# Altium schematic sheet Peripherals.SchDoc
size A3; SheetNumber: 3; SheetTotal: 5
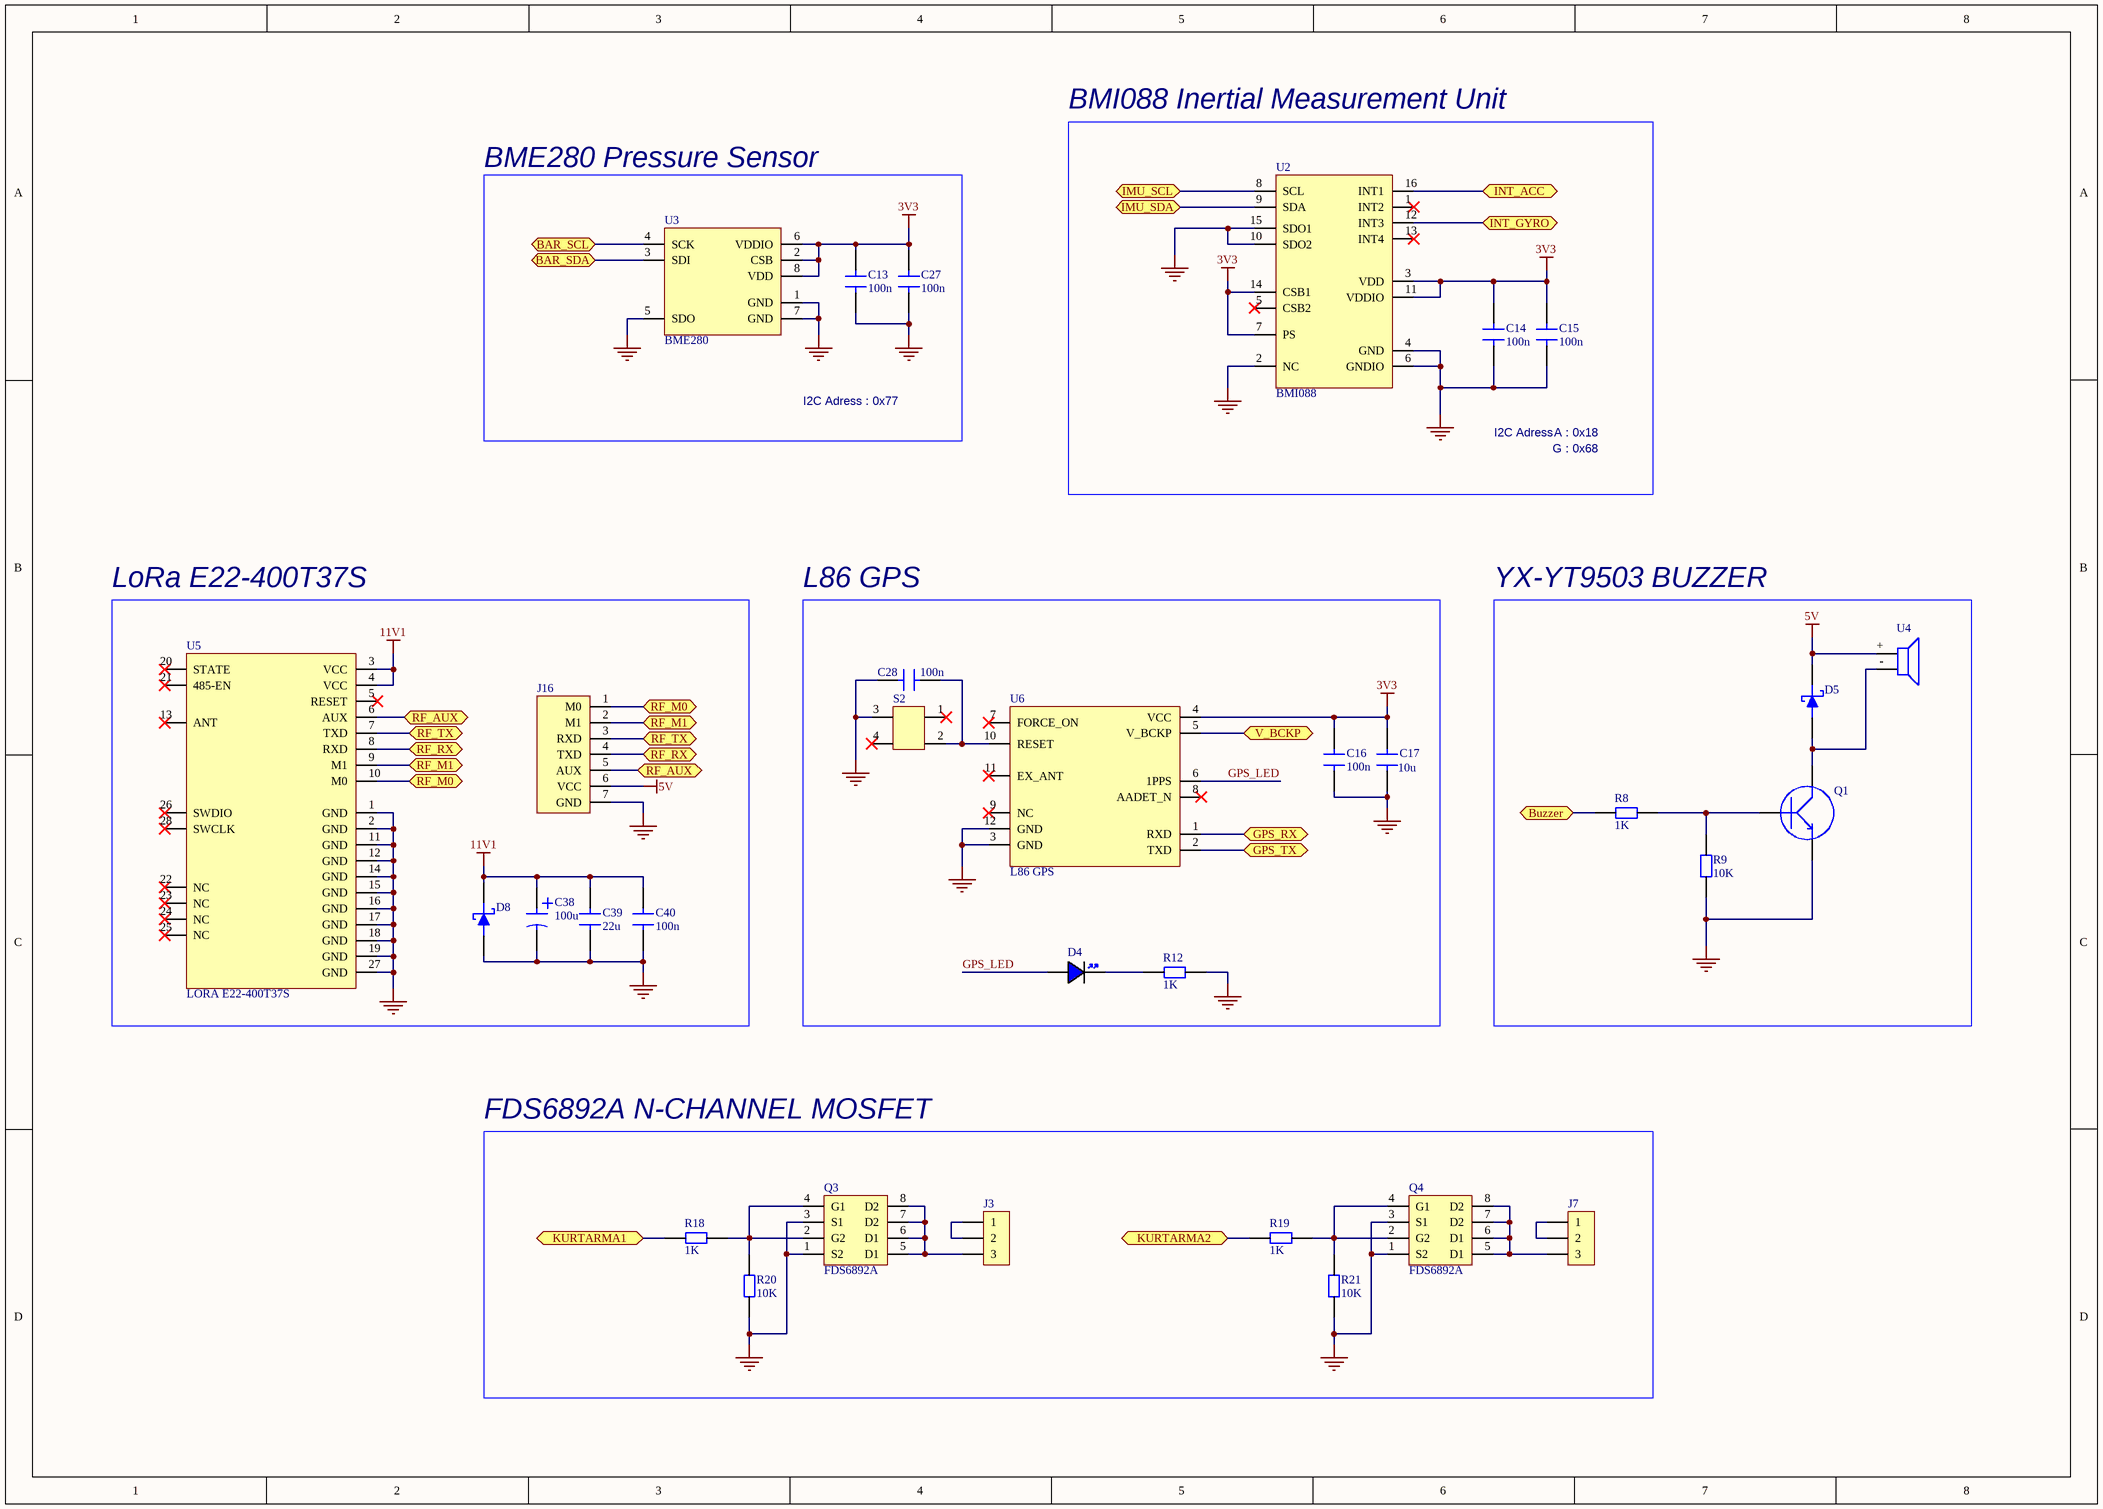
[diagram p0: Peripherals.SchDoc]

## Parts
C13  100n  [CAP 0603]
C14  100n  [CAP 0603]
C15  100n  [CAP 0603]
C16  100n  [CAP 0603]
C17  10u  [CAP 0805]
C27  100n  [CAP 0603]
C28  100n  [CAP 0603]
C38  100u  [865060653010]
C39  22u  [CAP 1210]
C40  100n  [CAP 0805]
D4  LED 0805 BLUE  [LED 0805 BLUE]  (value not drawn)
D5  TMBAT49FILM  [TMBAT49FILM]  (value not drawn)
D8  SMBJ14CA  [SMBJ12CA-13-F]  (value not drawn)
J3  JST B3B-XH-A  [JST_B3B-XH-A]  (value not drawn)
J7  JST B3B-XH-A  [JST_B3B-XH-A]  (value not drawn)
J16  LoRa E22-433T30D H  [LoRa E22-433T30D H]  (value not drawn)
Q1  BC817-25W,115  [BC817-25]  (value not drawn)
Q3  FDS6892A  [DMG4822SSD-13]
Q4  FDS6892A  [DMG4822SSD-13]
R8  1K  [RES 0603]
R9  10K  [RES 0603]
R12  1K  [RES 0603]
R18  1K  [RES 0805]
R19  1K  [RES 0805]
R20  10K  [RES 0805]
R21  10K  [RES 0805]
S2  FSM4JSMATR  [FSM4JSMATR]  (value not drawn)
U2  BMI088  [BMI088]
U3  BME280  [BME280]
U4  YX-YT9503  [YX-YT9503]  (value not drawn)
U5  LORA E22-400T37S  [LORA E22-400T37S]
U6  L86 GPS  [L86]

## Blocks framed on the sheet
BMI088 Inertial Measurement Unit: C14 C15 U2
BME280 Pressure Sensor: C13 C27 U3
LoRa E22-400T37S: C38-C40 D8 J16 U5
L86 GPS: C16 C17 C28 D4 R12 S2 U6
YX-YT9503 BUZZER: D5 Q1 R8 R9 U4
FDS6892A N-CHANNEL MOSFET: J3 J7 Q3 Q4 R18-R21

## Ports
BAR_SCL (bidir, see Connectors[3C], MCU[4C]), BAR_SDA (bidir, see Connectors[3C], MCU[4C]), Buzzer (bidir, see MCU[4C]), GPS_RX (bidir, see MCU[4B]), GPS_TX (bidir, see MCU[4B]), IMU_SCL (bidir, see Connectors[4C], MCU[4B]), IMU_SDA (bidir, see Connectors[4C], MCU[2C]), INT_ACC (bidir, see MCU[4C]), INT_GYRO (bidir, see MCU[4C]), KURTARMA1 (bidir, see MCU[2C]), KURTARMA2 (bidir, see MCU[2C]), RF_AUX (bidir, see MCU[4C], Peripherals[2B]), RF_AUX (bidir, see MCU[4C], Peripherals[3C]), RF_M0 (bidir, see MCU[2C], Peripherals[2C]), RF_M0 (bidir, see MCU[2C], Peripherals[3B]), RF_M1 (bidir, see MCU[2C], Peripherals[2C]), RF_M1 (bidir, see MCU[2C], Peripherals[3B]), RF_RX (bidir, see MCU[4B], Peripherals[2B]), RF_RX (bidir, see MCU[4B], Peripherals[3B]), RF_TX (bidir, see MCU[4B], Peripherals[2B]), RF_TX (bidir, see MCU[4B], Peripherals[3B]), V_BCKP (bidir, see MCU[3A], Power[3C])

## Nets
3V3: C13.2 C14.2 C15.2 C16.2 C17.2 C27.2 U2.3(VDD) U2.7(PS) U2.11(VDDIO) U2.14(CSB1) U3.2(CSB) U3.6(VDDIO) U3.8(VDD) U6.4(VCC)
5V: D5.1 J16.6(VCC) U4.+
11V1: C38.1(P) C39.2 C40.2 D8.2 U5.3(VCC) U5.4(VCC)
GND: C13.1 C14.1 C15.1 C16.1 C17.1 C27.1 C28.1 C38.2(N) C39.1 C40.1 D8.1 J16.7(GND) Q1.2(E) Q3.1(S2) Q3.3(S1) Q4.1(S2) Q4.3(S1) R9.1 R12.2 R20.1 R21.1 S2.3 U2.2(NC) U2.4(GND) U2.6(GNDIO) U2.10(SDO2) U2.15(SDO1) U3.1(GND) U3.5(SDO) U3.7(GND) U5.1(GND) U5.2(GND) U5.11(GND) U5.12(GND) U5.14(GND) U5.15(GND) U5.16(GND) U5.17(GND) U5.18(GND) U5.19(GND) U5.27(GND) U6.3(GND) U6.12(GND)
BAR_SCL: U3.4(SCK) ; port BAR_SCL
BAR_SDA: U3.3(SDI) ; port BAR_SDA
Buzzer: R8.1 ; port Buzzer
GPS_LED: D4.A U6.6(1PPS)
GPS_RX: U6.1(RXD) ; port GPS_RX
GPS_TX: U6.2(TXD) ; port GPS_TX
IMU_SCL: U2.8(SCL) ; port IMU_SCL
IMU_SDA: U2.9(SDA) ; port IMU_SDA
INT_ACC: U2.16(INT1) ; port INT_ACC
INT_GYRO: U2.12(INT3) ; port INT_GYRO
KURTARMA1: R18.1 ; port KURTARMA1
KURTARMA2: R19.1 ; port KURTARMA2
RF_AUX: J16.5(AUX) U5.6(AUX) ; port RF_AUX
RF_M0: J16.1(M0) U5.10(M0) ; port RF_M0
RF_M1: J16.2(M1) U5.9(M1) ; port RF_M1
RF_RX: J16.4(TXD) U5.8(RXD) ; port RF_RX
RF_TX: J16.3(RXD) U5.7(TXD) ; port RF_TX
V_BCKP: U6.5(V_BCKP) ; port V_BCKP
NetC28_2: C28.2 S2.2 U6.10(RESET)
NetD4_K: D4.K R12.1
NetD5_2: D5.2 Q1.3(C) U4.-
NetJ3_1: J3.1 J3.2
NetJ3_3: J3.3 Q3.5(D1) Q3.6(D1) Q3.7(D2) Q3.8(D2)
NetJ7_1: J7.1 J7.2
NetJ7_3: J7.3 Q4.5(D1) Q4.6(D1) Q4.7(D2) Q4.8(D2)
NetQ1_1: Q1.1(B) R8.2 R9.2
NetQ3_2: Q3.2(G2) Q3.4(G1) R18.2 R20.2
NetQ4_2: Q4.2(G2) Q4.4(G1) R19.2 R21.2

Not connected (* = marked no-connect by the designer): S2 1* 4*; U2 1(INT2)* 5(CSB2)* 13(INT4)*; U5 5(RESET)* 13(ANT)* 20(STATE)* 21(485-EN)* 22(NC)* 23(NC)* 24(NC)* 25(NC)* 26(SWDIO)* 28(SWCLK)*; U6 7(FORCE_ON)* 8(AADET_N)* 9(NC)* 11(EX_ANT)*

## Notes on the sheet
- I2C Adress : 0x77
- I2C Adress
- G : 0x68
- A : 0x18

## Library data of the parts
C13-C16 C27 C28 = CAP 0603 50V: Capacitor SMD 0603 50V
C17 = CAP 0805 25V: Capacitor SMD 0805 25V
C38 = 865060653010: Aluminum Electrolytic Capacitor, Polarized, Aluminum (wet), 50V, 20% +Tol, 20% -Tol, 100uF, Surface Mount, 3333; Manufacturer: Wurth Electronics; Supplier 1: Farnell; Manufacturer Part Number: 865060653010; RoHS: Yes; Category: Aluminum Electrolytic Capacitors; Stock 1: 176; Pricing 1: 1=0,825, 10=0,63, 50=0,551, 100=0,481, 200=0,427, 500=0,355, 2500=0,348, 5000=0,341 (EUR); ComponentLink1URL: http://www.farnell.com/datasheets/1880078.pdf?src-supplier=Farnell; ComponentLink1Description: http://www.farnell.com/datasheets/1880078.pdf?src-supplier=Farnell; ComponentLink2URL: http://www.farnell.com/datasheets/1880078.pdf?src-supplier=Newark; ComponentLink2Description: http://www.farnell.com/datasheets/1880078.pdf?src-supplier=Newark; ComponentLink3URL: http://www.farnell.com/datasheets/1880078.pdf?src-supplier=Element14; ComponentLink3Description: http://www.farnell.com/datasheets/1880078.pdf?src-supplier=Element14; ComponentLink4URL: https://katalog.we-online.de/pbs/datasheet/865060653010.pdf?src-supplier=Digikey; ComponentLink4Description: https://katalog.we-online.de/pbs/datasheet/865060653010.pdf?src-supplier=Digikey
C39 = CAP 1210 25V: Capacitor SMD 1210 25V
C40 = CAP 0805 50V: Capacitor SMD 0805 50V
D4 = LED 0805 BLUE: LED 0805 GREEN SMD
D5 = TMBAT49FILM: Rectifier Diode Small Signal Schottky Si 80V 0.5A 2-Pin MELF T/R; Manufacturer: STMicroelectronics; Supplier 1: Mouser; Manufacturer Part Number: TMBAT49FILM; RoHS: Yes; Category: Rectifier Diodes; Stock 1: 11456; Pricing 1: 1=0,55, 10=0,468, 50=0,468, 100=0,326, 1000=0,228, 10000=0,159 (USD); ComponentLink1URL: https://datasheet.ciiva.com/4715/cd00000809-92451-4715102.pdf?src-supplier=Mouser; ComponentLink1Description: https://datasheet.ciiva.com/4715/cd00000809-92451-4715102.pdf?src-supplier=Mouser; ComponentLink2URL: https://datasheet.ciiva.com/16988/0900766b80db299a-16988744.pdf?src-supplier=Allied+Electronics; ComponentLink2Description: https://datasheet.ciiva.com/16988/0900766b80db299a-16988744.pdf?src-supplier=Allied+Electronics; ComponentLink3URL: https://datasheet.ciiva.com/22697/1766334-22697011.pdf?src-supplier=Element14; ComponentLink3Description: https://datasheet.ciiva.com/22697/1766334-22697011.pdf?src-supplier=Element14; ComponentLink4URL: https://datasheet.ciiva.com/16501/cd00000809-16501349.pdf?src-supplier=Future+Electronics; ComponentLink4Description: https://datasheet.ciiva.com/16501/cd00000809-16501349.pdf?src-supplier=Future+Electronics; ComponentLink5URL: https://datasheet.ciiva.com/15144/getdatasheetpartid-39750-15144086.pdf?src-supplier=Verical; ComponentLink5Description: https://datasheet.ciiva.com/15144/getdatasheetpartid-39750-15144086.pdf?src-supplier=Verical; ComponentLink6URL: https://datasheet.ciiva.com/915/cd00000809-915819.pdf?src-supplier=Digikey; ComponentLink6Description: https://datasheet.ciiva.com/915/cd00000809-915819.pdf?src-supplier=Digikey; ComponentLink7URL: https://datasheet.ciiva.com/915/cd00000809-915820.pdf?src-supplier=Digikey; ComponentLink7Description: https://datasheet.ciiva.com/915/cd00000809-915820.pdf?src-supplier=Digikey; ComponentLink8URL: https://datasheet.ciiva.com/915/cd00000809-915821.pdf?src-supplier=Digikey; ComponentLink8Description: https://datasheet.ciiva.com/915/cd00000809-915821.pdf?src-supplier=Digikey; ComponentLink9URL: https://datasheet.ciiva.com/7622/1766334-7622348.pdf?src-supplier=Element14; ComponentLink9Description: https://datasheet.ciiva.com/7622/1766334-7622348.pdf?src-supplier=Element14; ComponentLink10URL: https://datasheet.ciiva.com/7964/cd00000809-7964118.pdf?src-supplier=Element14; ComponentLink10Description: https://datasheet.ciiva.com/7964/cd00000809-7964118.pdf?src-supplier=Element14
D8 = SMBJ14CA: TVS DIODE 14VWM 23.2VC DO214AA; Manufacturer: Littelfuse; Operating Supply Voltage: 14V; Max Surge Current: 25.9A; Number of Channels: 1; Polarity: Bidirectional; Breakdown Voltage: 15.6V; Clamping Voltage: 23.2V; Peak Pulse Power: 600W; Power Line Protection: No; Test Current: 1mA; Leakage Current: 1uA; Diode Type: ZENER; Max Breakdown Voltage: 17.2V; Supplier 1: Future Electronics; Manufacturer Part Number: SMBJ14CA; RoHS: Yes; Category: TVS Diodes; Stock 1: 1300; Pricing 1: 1=0,36, 15=0,29, 75=0,245, 300=0,205, 1500=0,163 (USD); Mount: Surface Mount; Case/Package: DO-214AA; Number of Pins: 2; Weight: 0.00328oz; Min Operating Temperature: -65°C; Max Operating Temperature: 150°C; Packaging: Tape and Reel; Package Quantity: 3000; Reverse Breakdown Voltage: 15.6V; Number of Bidirectional Channels: 1; Reverse Standoff Voltage: 14V; Min Breakdown Voltage: 15.6V; Number of Elements: 1; Peak Pulse Current: 25.9A; Voltage Rating (DC): 14V; Series: SMBJ; Direction: Bidirectional; Termination: SMD/SMT; Max Power Dissipation: 600W; Power Dissipation: 600W; Current: 1mA; Voltage: 14V; Clamping Voltage-Max: 23.2V; Length: 5.59mm; Width: 3.94mm; Height: 2.44mm; RoHS Compliant: Yes; Lead Free: Lead Free; Reach SVHC Compliant: No; ComponentLink1URL: https://datasheet.ciiva.com/331/littelfuse-tvs-diode-smbj-datasheet-pdf-331530.pdf?src-supplier=Digikey; ComponentLink1Description: https://datasheet.ciiva.com/331/littelfuse-tvs-diode-smbj-datasheet-pdf-331530.pdf?src-supplier=Digikey; ComponentLink2URL: https://datasheet.ciiva.com/331/littelfuse-tvs-diode-smbj-datasheet-pdf-331531.pdf?src-supplier=Digikey; ComponentLink2Description: https://datasheet.ciiva.com/331/littelfuse-tvs-diode-smbj-datasheet-pdf-331531.pdf?src-supplier=Digikey; ComponentLink3URL: https://datasheet.ciiva.com/331/littelfuse-tvs-diode-smbj-datasheet-pdf-331529.pdf?src-supplier=Digikey; ComponentLink3Description: https://datasheet.ciiva.com/331/littelfuse-tvs-diode-smbj-datasheet-pdf-331529.pdf?src-supplier=Digikey
J3 J7 = JST B3B-XH-A: Connector Header, XH Series, 3 Position, 2.50mm, Through Hole, Press-Fit, Solder, Natural; Manufacturer Part Number: B3B-XH-A(LF)(SN); Supplier 1: CoreStaff; Manufacturer: JST; RoHS: Yes; Category: Headers and Wire Housings; Stock 1: 2101; Pricing 1: 1=39,94, 10=25,1, 50=21,68, 100=18,25, 500=17,57, 1000=17,12, 2000=16,44, 4000=15,79 (JPY); ComponentLink1URL: https://datasheet.ciiva.com/26894/getdatasheetpartid-640434-26894454.pdf?src-supplier=Verical; ComponentLink1Description: https://datasheet.ciiva.com/26894/getdatasheetpartid-640434-26894454.pdf?src-supplier=Verical; ComponentLink2URL: https://datasheet.ciiva.com/26894/getdatasheetpartid-440399-26894778.pdf?src-supplier=Verical; ComponentLink2Description: https://datasheet.ciiva.com/26894/getdatasheetpartid-440399-26894778.pdf?src-supplier=Verical; ComponentLink3URL: https://datasheet.ciiva.com/11746/0900766b8082653f-11746520.pdf?src-supplier=Rs; ComponentLink3Description: https://datasheet.ciiva.com/11746/0900766b8082653f-11746520.pdf?src-supplier=Rs
J16 = LoRa E22-433T30D H: E220-400T30D LoRa Module Header
Q1 = BC817-25W,115: BC817 Series 45 V 500 mA NPN General Purpose Transistor - SOT-23; Manufacturer: Nexperia; Supplier 1: Future Electronics; Manufacturer Part Number: BC817-25W,115; RoHS: Yes; Category: BJTs; Stock 1: 99000; Pricing 1: 3000=0,0169, 12000=0,0162, 45000=0,0155, 90000=0,0152, 225000=0,0144 (USD); ComponentLink1URL: https://datasheet.octopart.com/BC817-25W%2C115-NXP-datasheet-29749.pdf?src-supplier=Future+Electronics; ComponentLink1Description: https://datasheet.octopart.com/BC817-25W%2C115-NXP-datasheet-29749.pdf?src-supplier=Future+Electronics; ComponentLink2URL: http://www.farnell.com/datasheets/699988.pdf?src-supplier=Newark; ComponentLink2Description: http://www.farnell.com/datasheets/699988.pdf?src-supplier=Newark; ComponentLink3URL: https://datasheet.octopart.com/BC817-25W%2C115-Nexperia-datasheet-155782301.pdf?src-supplier=TME; ComponentLink3Description: https://datasheet.octopart.com/BC817-25W%2C115-Nexperia-datasheet-155782301.pdf?src-supplier=TME; Supplier Part Number 1: 5067352
Q3 Q4 = FDS6892A: Dual N-Channel Logic Level PWM Optimized PowerTrench® MOSFET 20V, 7.5A, 18mΩ; Manufacturer: ON Semiconductor / Fairchild; Supplier 1: Arrow Electronics; Manufacturer Part Number: FDS6892A; RoHS: Yes; Category: MOSFETs; Stock 1: 45; Pricing 1: 1=0,4552, 539=0,4077 (USD); ComponentLink1URL: https://datasheet.ciiva.com/15137/getdatasheetpartid-60185-15137252.pdf?src-supplier=Verical; ComponentLink1Description: https://datasheet.ciiva.com/15137/getdatasheetpartid-60185-15137252.pdf?src-supplier=Verical; ComponentLink2URL: https://datasheet.ciiva.com/8114/fds6892a-8114609.pdf?src-supplier=Avnet; ComponentLink2Description: https://datasheet.ciiva.com/8114/fds6892a-8114609.pdf?src-supplier=Avnet; ComponentLink3URL: https://datasheet.ciiva.com/6076/89392-6076006.pdf?src-supplier=Farnell; ComponentLink3Description: https://datasheet.ciiva.com/6076/89392-6076006.pdf?src-supplier=Farnell; ComponentLink4URL: https://datasheet.ciiva.com/4442/fds6892a-108922-4442276.pdf?src-supplier=Mouser; ComponentLink4Description: https://datasheet.ciiva.com/4442/fds6892a-108922-4442276.pdf?src-supplier=Mouser; ComponentLink5URL: https://datasheet.ciiva.com/16777/fds6892a-16777782.pdf?src-supplier=Future+Electronics; ComponentLink5Description: https://datasheet.ciiva.com/16777/fds6892a-16777782.pdf?src-supplier=Future+Electronics; ComponentLink6URL: https://datasheet.ciiva.com/6386/fds6892a-6386538.pdf?src-supplier=Digikey; ComponentLink6Description: https://datasheet.ciiva.com/6386/fds6892a-6386538.pdf?src-supplier=Digikey
R8 R9 R12 = RES 0603: Resistor SMD 0603
R18-R21 = RES 0805: Resistor SMD 0805
S2 = FSM4JSMATR: Switch Tactile OFF (ON) SPST Round Button Gull Wing 0.05A 24VDC 1.57N SMD T/R; Manufacturer: TE Connectivity Alcoswitch; Supplier 1: Digi-Key; Manufacturer Part Number: FSM4JSMATR; RoHS: Yes; Category: Pushbutton Switches; Stock 1: 84996; Pricing 1: 1=0,36, 10=0,351, 25=0,33, 100=0,2866, 250=0,26, 500=0,24188 (USD); ComponentLink1URL: https://datasheet.ciiva.com/16320/eng-cs-1308111-1-switches-core-program-catalog-0308-16320065.pdf?src-supplier=Future+Electronics; ComponentLink1Description: https://datasheet.ciiva.com/16320/eng-cs-1308111-1-switches-core-program-catalog-0308-16320065.pdf?src-supplier=Future+Electronics; ComponentLink2URL: https://datasheet.ciiva.com/1530/1683375-1530944.pdf?src-supplier=Element14; ComponentLink2Description: https://datasheet.ciiva.com/1530/1683375-1530944.pdf?src-supplier=Element14; ComponentLink3URL: https://datasheet.ciiva.com/23765/1486934-23765878.pdf?src-supplier=Newark; ComponentLink3Description: https://datasheet.ciiva.com/23765/1486934-23765878.pdf?src-supplier=Newark; ComponentLink4URL: https://datasheet.ciiva.com/7638/921681-7638037.pdf?src-supplier=Element14; ComponentLink4Description: https://datasheet.ciiva.com/7638/921681-7638037.pdf?src-supplier=Element14
U2 = BMI088: BMI088 Series 3.6 V 6 Axis Digital Output Accelerometer Motion Sensor - LGA-16; Manufacturer: Bosch Tools; Supplier 1: Arrow Electronics; Manufacturer Part Number: BMI088; RoHS: No; Category: Inertial Measurement Units (IMUs); Stock 1: 2228; Pricing 1: 1=3,4884, 10=3,3155, 25=3,2816, 50=3,2477, 100=3,2147, 500=3,1828 (USD); ComponentLink1URL: https://ae-bst.resource.bosch.com/media/_tech/media/product_flyer/Bosch_Sensortec_Product_flyer_BMI088.pdf?src-supplier=Digi-Key; ComponentLink1Description: https://ae-bst.resource.bosch.com/media/_tech/media/product_flyer/Bosch_Sensortec_Product_flyer_BMI088.pdf?src-supplier=Digi-Key; ComponentLink2URL: https://ae-bst.resource.bosch.com/media/_tech/media/application_notes/BST-MIS-HS001.pdf?src-supplier=Digi-Key; ComponentLink2Description: https://ae-bst.resource.bosch.com/media/_tech/media/application_notes/BST-MIS-HS001.pdf?src-supplier=Digi-Key
U3 = BME280: SENSOR PRESSURE HUMIDITY TEMP; Manufacturer: Bosch; Sensor Type: Temperature; Output Type: SPI,I2C; Accuracy: 3%; Response Time: 1s; Supplier 1: Future Electronics; Manufacturer Part Number: BME280; RoHS: No; Category: Temperature and Humidity Sensors; Stock 1: 5185; Pricing 1: 1=6,1, 20=5,53, 150=5,14, 1000=4,78, 5000=4,48 (USD); Mount: Surface Mount; Case/Package: LGA; Number of Pins: 8; Min Operating Temperature: -40°C; Max Operating Temperature: 85°C; Packaging: Cut Tape; Lead Free: Lead Free; ComponentLink1URL: https://ae-bst.resource.bosch.com/media/_tech/media/datasheets/BST-BME280-DS002.pdf?src-supplier=Digi-Key; ComponentLink1Description: https://ae-bst.resource.bosch.com/media/_tech/media/datasheets/BST-BME280-DS002.pdf?src-supplier=Digi-Key; ComponentLink2URL: https://ae-bst.resource.bosch.com/media/_tech/media/product_flyer/BME280_Productflyer_BST_20170109.pdf?src-supplier=Mouser; ComponentLink2Description: https://ae-bst.resource.bosch.com/media/_tech/media/product_flyer/BME280_Productflyer_BST_20170109.pdf?src-supplier=Mouser; ComponentLink3URL: https://ae-bst.resource.bosch.com/media/_tech/media/product_flyer/BME280_Productflyer_BST_20170109.pdf?src-supplier=Arrow+Electronics; ComponentLink3Description: https://ae-bst.resource.bosch.com/media/_tech/media/product_flyer/BME280_Productflyer_BST_20170109.pdf?src-supplier=Arrow+Electronics; ComponentLink4URL: https://ae-bst.resource.bosch.com/media/_tech/media/product_flyer/BME280_Productflyer_BST_20170109.pdf?src-supplier=NAC+Semi; ComponentLink4Description: https://ae-bst.resource.bosch.com/media/_tech/media/product_flyer/BME280_Productflyer_BST_20170109.pdf?src-supplier=NAC+Semi
U4 = YX-YT9503: BUZZER MAGNETIC WITH CIRCUIT 3V 2.7-KHZ THT
U5 = LORA E22-400T37S: E22-400T37S LoRa Module